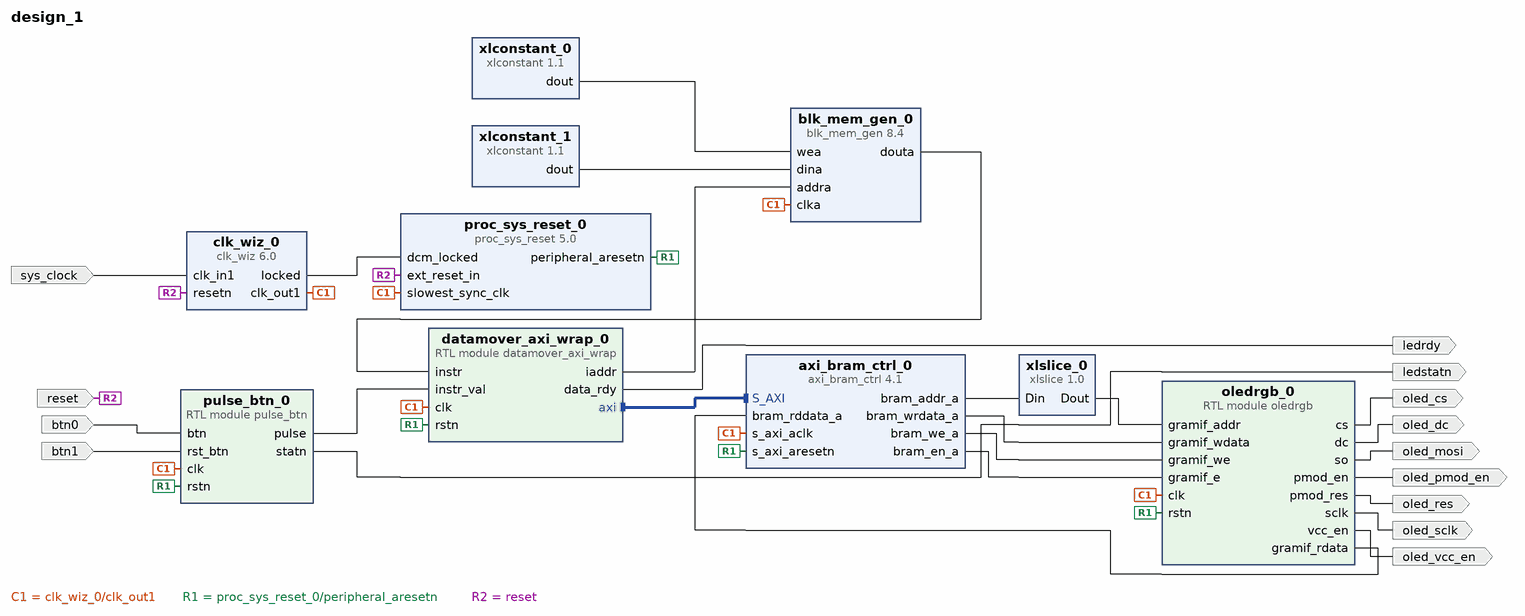
[diagram p0: block diagram of the top level]
# Vivado block design design_1, xc7a35ticsg324-1L, Vivado 2020.2
create_bd_design design_1

create_bd_port -dir I -type clk sys_clock
set_property -dict {CONFIG.FREQ_HZ 100000000 CONFIG.PHASE 0.000} [get_bd_ports sys_clock]
create_bd_port -dir I -type rst reset
set_property -dict {CONFIG.POLARITY ACTIVE_LOW} [get_bd_ports reset]
create_bd_port -dir I -type data btn0
create_bd_port -dir I -type data btn1
create_bd_port -dir O -type data oled_cs
create_bd_port -dir O -type data oled_mosi
create_bd_port -dir O -type data oled_sclk
create_bd_port -dir O -type data oled_dc
create_bd_port -dir O -type data oled_res
create_bd_port -dir O -type data oled_vcc_en
create_bd_port -dir O -type data oled_pmod_en
create_bd_port -dir O -type data ledrdy
create_bd_port -dir O -type data ledstatn

create_bd_cell -type ip -vlnv xilinx.com:ip:proc_sys_reset:5.0 proc_sys_reset_0
create_bd_cell -type module -reference pulse_btn pulse_btn_0
create_bd_cell -type module -reference oledrgb oledrgb_0
set_property -dict {CONFIG.NS_PER_CLK 100} [get_bd_cells oledrgb_0]
create_bd_cell -type ip -vlnv xilinx.com:ip:blk_mem_gen:8.4 blk_mem_gen_0
set_property -dict [list \
  CONFIG.Coe_File datamover_axi.coe \
  CONFIG.Enable_32bit_Address false \
  CONFIG.Enable_A Always_Enabled \
  CONFIG.Fill_Remaining_Memory_Locations true \
  CONFIG.Load_Init_File true \
  CONFIG.Read_Width_A 28 \
  CONFIG.Register_PortA_Output_of_Memory_Primitives false \
  CONFIG.Remaining_Memory_Locations 0 \
  CONFIG.Use_Byte_Write_Enable false \
  CONFIG.Use_RSTA_Pin false \
  CONFIG.Write_Depth_A 1024 \
  CONFIG.Write_Width_A 28 \
  CONFIG.use_bram_block Stand_Alone \
] [get_bd_cells blk_mem_gen_0]
create_bd_cell -type ip -vlnv xilinx.com:ip:xlslice:1.0 xlslice_0
set_property -dict {CONFIG.DIN_FROM 13 CONFIG.DIN_TO 2 CONFIG.DIN_WIDTH 14 CONFIG.DOUT_WIDTH 12} [get_bd_cells xlslice_0]
create_bd_cell -type ip -vlnv xilinx.com:ip:axi_bram_ctrl:4.1 axi_bram_ctrl_0
set_property -dict {CONFIG.PROTOCOL AXI4LITE CONFIG.SINGLE_PORT_BRAM 1} [get_bd_cells axi_bram_ctrl_0]
create_bd_cell -type ip -vlnv xilinx.com:ip:clk_wiz:6.0 clk_wiz_0
set_property -dict [list \
  CONFIG.CLKOUT1_JITTER 290.478 \
  CONFIG.CLKOUT1_PHASE_ERROR 133.882 \
  CONFIG.CLKOUT1_REQUESTED_OUT_FREQ 10.000 \
  CONFIG.CLK_IN1_BOARD_INTERFACE sys_clock \
  CONFIG.MMCM_CLKFBOUT_MULT_F 15.625 \
  CONFIG.MMCM_CLKIN1_PERIOD 10.000 \
  CONFIG.MMCM_CLKIN2_PERIOD 10.000 \
  CONFIG.MMCM_CLKOUT0_DIVIDE_F 78.125 \
  CONFIG.MMCM_DIVCLK_DIVIDE 2 \
  CONFIG.RESET_BOARD_INTERFACE reset \
  CONFIG.RESET_PORT resetn \
  CONFIG.RESET_TYPE ACTIVE_LOW \
  CONFIG.USE_BOARD_FLOW true \
] [get_bd_cells clk_wiz_0]
create_bd_cell -type ip -vlnv xilinx.com:ip:xlconstant:1.1 xlconstant_0
set_property -dict {CONFIG.CONST_VAL 0} [get_bd_cells xlconstant_0]
create_bd_cell -type ip -vlnv xilinx.com:ip:xlconstant:1.1 xlconstant_1
set_property -dict {CONFIG.CONST_VAL 0 CONFIG.CONST_WIDTH 28} [get_bd_cells xlconstant_1]
create_bd_cell -type module -reference datamover_axi_wrap datamover_axi_wrap_0
set_property -dict {CONFIG.AWIDTH 12 CONFIG.IAWIDTH 10} [get_bd_cells datamover_axi_wrap_0]

# ---- connections ----

connect_bd_intf_net [get_bd_intf_pins axi_bram_ctrl_0/S_AXI] [get_bd_intf_pins datamover_axi_wrap_0/axi]
connect_bd_net [get_bd_pins datamover_axi_wrap_0/iaddr] [get_bd_pins blk_mem_gen_0/addra]
connect_bd_net [get_bd_pins blk_mem_gen_0/douta] [get_bd_pins datamover_axi_wrap_0/instr]
connect_bd_net [get_bd_pins clk_wiz_0/clk_out1] \
  [get_bd_pins proc_sys_reset_0/slowest_sync_clk] [get_bd_pins pulse_btn_0/clk] [get_bd_pins oledrgb_0/clk] \
  [get_bd_pins blk_mem_gen_0/clka] [get_bd_pins axi_bram_ctrl_0/s_axi_aclk] [get_bd_pins datamover_axi_wrap_0/clk]
connect_bd_net -net clk_wiz_0_locked [get_bd_pins proc_sys_reset_0/peripheral_aresetn] \
  [get_bd_pins pulse_btn_0/rstn] [get_bd_pins oledrgb_0/rstn] [get_bd_pins axi_bram_ctrl_0/s_axi_aresetn] \
  [get_bd_pins datamover_axi_wrap_0/rstn]
connect_bd_net [get_bd_pins xlconstant_0/dout] [get_bd_pins blk_mem_gen_0/wea]
connect_bd_net [get_bd_pins xlconstant_1/dout] [get_bd_pins blk_mem_gen_0/dina]
connect_bd_net [get_bd_pins axi_bram_ctrl_0/bram_wrdata_a] [get_bd_pins oledrgb_0/gramif_wdata]
connect_bd_net [get_bd_ports sys_clock] [get_bd_pins clk_wiz_0/clk_in1]
connect_bd_net [get_bd_ports reset] [get_bd_pins proc_sys_reset_0/ext_reset_in] [get_bd_pins clk_wiz_0/resetn]
connect_bd_net [get_bd_pins clk_wiz_0/locked] [get_bd_pins proc_sys_reset_0/dcm_locked]
connect_bd_net -net btn0_1 [get_bd_ports btn0] [get_bd_pins pulse_btn_0/btn]
connect_bd_net -net btn1_1 [get_bd_ports btn1] [get_bd_pins pulse_btn_0/rst_btn]
connect_bd_net [get_bd_pins pulse_btn_0/pulse] [get_bd_pins datamover_axi_wrap_0/instr_val]
connect_bd_net [get_bd_pins oledrgb_0/gramif_rdata] [get_bd_pins axi_bram_ctrl_0/bram_rddata_a]
connect_bd_net [get_bd_pins axi_bram_ctrl_0/bram_we_a] [get_bd_pins oledrgb_0/gramif_we]
connect_bd_net [get_bd_pins axi_bram_ctrl_0/bram_en_a] [get_bd_pins oledrgb_0/gramif_e]
connect_bd_net [get_bd_pins oledrgb_0/pmod_en] [get_bd_ports oled_pmod_en]
connect_bd_net [get_bd_pins oledrgb_0/pmod_res] [get_bd_ports oled_res]
connect_bd_net [get_bd_pins oledrgb_0/vcc_en] [get_bd_ports oled_vcc_en]
connect_bd_net [get_bd_pins oledrgb_0/dc] [get_bd_ports oled_dc]
connect_bd_net [get_bd_pins oledrgb_0/sclk] [get_bd_ports oled_sclk]
connect_bd_net [get_bd_pins oledrgb_0/so] [get_bd_ports oled_mosi]
connect_bd_net [get_bd_pins oledrgb_0/cs] [get_bd_ports oled_cs]
connect_bd_net [get_bd_pins datamover_axi_wrap_0/data_rdy] [get_bd_ports ledrdy]
connect_bd_net [get_bd_pins pulse_btn_0/statn] [get_bd_ports ledstatn]
connect_bd_net [get_bd_pins axi_bram_ctrl_0/bram_addr_a] [get_bd_pins xlslice_0/Din]
connect_bd_net [get_bd_pins xlslice_0/Dout] [get_bd_pins oledrgb_0/gramif_addr]

# ---- address map ----
assign_bd_address -offset 0x00000000 -range 16K -target_address_space [get_bd_addr_spaces datamover_axi_wrap_0/axi] [get_bd_addr_segs axi_bram_ctrl_0/S_AXI/Mem0]

validate_bd_design
save_bd_design
